# Altium schematic sheet DC_DC_5V_2.SchDoc
size Tabloid; Date: Date; Author: Author 1; DocumentNumber: 4; Revision: 1; SheetNumber: 4; SheetTotal: 7; Size: 11x17; Sheet_Name: 5V page 2
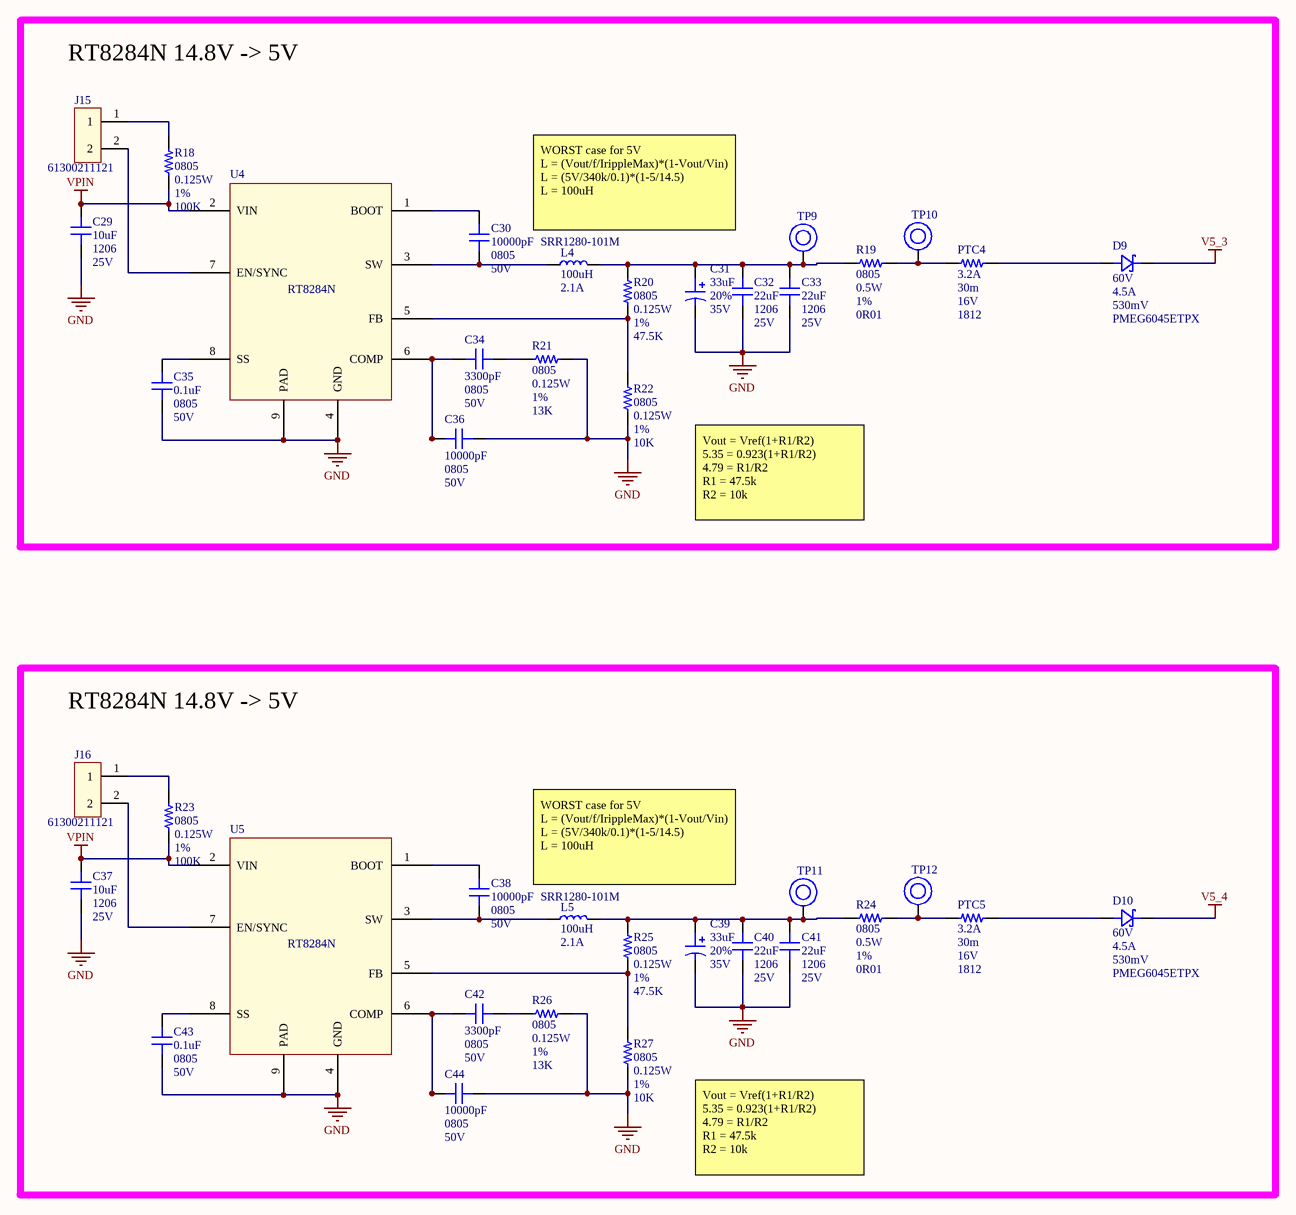
[diagram p0: DC_DC_5V_2.SchDoc]

## Parts
C29  value 10uF  Package: 1206  Voltage: 25V  [CAP_1206]  (hidden comment: CAP_‎CL31A106KAHNFNE‎)
C30  value 10000pF  Package: 0805  Voltage: 50V  [CAP_0805]  (hidden comment: CAP_‎‎‎‎CL21B103KBANNNC)
C31  value 33uF  Tolerance: 20%  Voltage: 35V  [CAP ALU - 6.3mm DIA]  (hidden comment: CAP_EEE-FK1V330P)
C32  value 22uF  Package: 1206  Voltage: 25V  [CAP_1206]  (hidden comment: CAP_‎‎CL31A226KAHNNNE‎)
C33  value 22uF  Package: 1206  Voltage: 25V  [CAP_1206]  (hidden comment: CAP_‎‎CL31A226KAHNNNE‎)
C34  value 3300pF  Package: 0805  Voltage: 50V  [CAP_0805]  (hidden comment: CAP_CL21B332KBANNNC‎)
C35  value 0.1uF  Package: 0805  Voltage: 50V  [CAP_0805]  (hidden comment: CAP_CC0805KRX7R9BB104‎)
C36  value 10000pF  Package: 0805  Voltage: 50V  [CAP_0805]  (hidden comment: CAP_‎‎‎‎CL21B103KBANNNC)
C37  value 10uF  Package: 1206  Voltage: 25V  [CAP_1206]  (hidden comment: CAP_‎CL31A106KAHNFNE‎)
C38  value 10000pF  Package: 0805  Voltage: 50V  [CAP_0805]  (hidden comment: CAP_‎‎‎‎CL21B103KBANNNC)
C39  value 33uF  Tolerance: 20%  Voltage: 35V  [CAP ALU - 6.3mm DIA]  (hidden comment: CAP_EEE-FK1V330P)
C40  value 22uF  Package: 1206  Voltage: 25V  [CAP_1206]  (hidden comment: CAP_‎‎CL31A226KAHNNNE‎)
C41  value 22uF  Package: 1206  Voltage: 25V  [CAP_1206]  (hidden comment: CAP_‎‎CL31A226KAHNNNE‎)
C42  value 3300pF  Package: 0805  Voltage: 50V  [CAP_0805]  (hidden comment: CAP_CL21B332KBANNNC‎)
C43  value 0.1uF  Package: 0805  Voltage: 50V  [CAP_0805]  (hidden comment: CAP_CC0805KRX7R9BB104‎)
C44  value 10000pF  Package: 0805  Voltage: 50V  [CAP_0805]  (hidden comment: CAP_‎‎‎‎CL21B103KBANNNC)
D9  Voltage: 60V  Current: 4.5A  Vf: 530mV  Part number: PMEG6045ETPX  [DO-214AC_SOD128]  (hidden comment: DIODE_SCH_PMEG6045ETPX)
D10  Voltage: 60V  Current: 4.5A  Vf: 530mV  Part number: PMEG6045ETPX  [DO-214AC_SOD128]  (hidden comment: DIODE_SCH_PMEG6045ETPX)
J15  Part number: 61300211121  [HDR1X2]  (hidden comment: Header 2 pin SM)
J16  Part number: 61300211121  [HDR1X2]  (hidden comment: Header 2 pin SM)
L4  value 100uH  Current: 2.1A  Part number: SRR1280-101M  [BOURNS 12.5x12.5mm]  (hidden comment: IND_SRR1280-101M)
L5  value 100uH  Current: 2.1A  Part number: SRR1280-101M  [BOURNS 12.5x12.5mm]  (hidden comment: IND_SRR1280-101M)
PTC4  Trip value: 3.2A  Res: 30m  Voltage: 16V  Package: 1812  [PTC - 1812]  (hidden comment: PTC_0ZCG0160BF2C)
PTC5  Trip value: 3.2A  Res: 30m  Voltage: 16V  Package: 1812  [PTC - 1812]  (hidden comment: PTC_0ZCG0160BF2C)
R18  value 100K  Package: 0805  Power: 0.125W  Tolerance: 1%  [RES_0805]  (hidden comment: RES_‎RMCF0805FT100K‎)
R19  value 0R01  Package: 0805  Power: 0.5W  Tolerance: 1%  [RES_0805]  (hidden comment: RES_‎‎‎‎‎ KRL1220E-M-R010-F-T5)
R20  value 47.5K  Package: 0805  Power: 0.125W  Tolerance: 1%  [RES_0805]  (hidden comment: RES_‎‎RMCF0805FT47K5‎)
R21  value 13K  Package: 0805  Power: 0.125W  Tolerance: 1%  [RES_0805]  (hidden comment: RES_‎ RC0805FR-0713KL)
R22  value 10K  Package: 0805  Power: 0.125W  Tolerance: 1%  [RES_0805]  (hidden comment: RES_‎RMCF0805FT10K0)
R23  value 100K  Package: 0805  Power: 0.125W  Tolerance: 1%  [RES_0805]  (hidden comment: RES_‎RMCF0805FT100K‎)
R24  value 0R01  Package: 0805  Power: 0.5W  Tolerance: 1%  [RES_0805]  (hidden comment: RES_‎‎‎‎‎ KRL1220E-M-R010-F-T5)
R25  value 47.5K  Package: 0805  Power: 0.125W  Tolerance: 1%  [RES_0805]  (hidden comment: RES_‎‎RMCF0805FT47K5‎)
R26  value 13K  Package: 0805  Power: 0.125W  Tolerance: 1%  [RES_0805]  (hidden comment: RES_‎ RC0805FR-0713KL)
R27  value 10K  Package: 0805  Power: 0.125W  Tolerance: 1%  [RES_0805]  (hidden comment: RES_‎RMCF0805FT10K0)
TP9  TestPoint 3x3mm  [TestPoint 3X3mm]  (value not drawn)
TP10  TestPoint 3x3mm  [TestPoint 3X3mm]  (value not drawn)
TP11  TestPoint 3x3mm  [TestPoint 3X3mm]  (value not drawn)
TP12  TestPoint 3x3mm  [TestPoint 3X3mm]  (value not drawn)
U4  REG_SW_RT8284N  [SOP8]  (value not drawn)
U5  REG_SW_RT8284N  [SOP8]  (value not drawn)

## Blocks framed on the sheet
RT8284N 14.8V -> 5V: C29-C36 D9 J15 L4 PTC4 R18-R22 TP9 TP10 U4
RT8284N 14.8V -> 5V: C37-C44 D10 J16 L5 PTC5 R23-R27 TP11 TP12 U5

## Nets
GND: C29.2 C31.2 C32.2 C33.2 C35.2 C36.2 C37.2 C39.2 C40.2 C41.2 C43.2 C44.2 R21.2 R22.2 R26.2 R27.2 U4.4(GND) U4.9(PAD) U5.4(GND) U5.9(PAD)
V5_3: D9.2
V5_4: D10.2
VPIN: C29.1 C37.1 R18.1 R23.1 U4.2(VIN) U5.2(VIN)
NetC30_1: C30.1 U4.1(BOOT)
NetC30_2: C30.2 L4.1 U4.3(SW)
NetC31_1: C31.1 C32.1 C33.1 L4.2 R19.1 R20.1 TP9.1
NetC34_1: C34.1 C36.1 U4.6(COMP)
NetC34_2: C34.2 R21.1
NetC35_1: C35.1 U4.8(SS)
NetC38_1: C38.1 U5.1(BOOT)
NetC38_2: C38.2 L5.1 U5.3(SW)
NetC39_1: C39.1 C40.1 C41.1 L5.2 R24.1 R25.1 TP11.1
NetC42_1: C42.1 C44.1 U5.6(COMP)
NetC42_2: C42.2 R26.1
NetC43_1: C43.1 U5.8(SS)
NetD9_1: D9.1 PTC4.2
NetD10_1: D10.1 PTC5.2
NetJ15_1: J15.1 R18.2
NetJ15_2: J15.2 U4.7(EN/SYNC)
NetJ16_1: J16.1 R23.2
NetJ16_2: J16.2 U5.7(EN/SYNC)
NetPTC4_1: PTC4.1 R19.2 TP10.1
NetPTC5_1: PTC5.1 R24.2 TP12.1
NetR20_2: R20.2 R22.1 U4.5(FB)
NetR25_2: R25.2 R27.1 U5.5(FB)

## Notes on the sheet
- WORST case for 5V
  L = (Vout/f/IrippleMax)*(1-Vout/Vin)
  L = (5V/340k/0.1)*(1-5/14.5)
  L = 100uH
- Vout = Vref(1+R1/R2)
  5.35 = 0.923(1+R1/R2)
  4.79 = R1/R2
  R1 = 47.5k
  R2 = 10k
- Sheet Name
- Project Title
- Global Project
- Size
- Group
- Revision
- Date
- Sheet
- of
- Filename
- Designers

## Library data of the parts
C29 C37 = CAP_‎CL31A106KAHNFNE‎: CAP CER 10uF 25V 1206; Part number: CL31A106KAHNFNE‎
C30 C36 C38 C44 = CAP_‎‎‎‎CL21B103KBANNNC: CAP CER 10000pF 50V 0805; Part number: ‎CL21B103KBANNNC
C31 C39 = CAP_EEE-FK1V330P: CAP ALU 33µF 35V; Part number: EEE-FK1V330P; Package: 6.30mm
C32 C33 C40 C41 = CAP_‎‎CL31A226KAHNNNE‎: CAP CER 22uF 25V 1206; Part number: CL31A226KAHNNNE‎
C34 C42 = CAP_CL21B332KBANNNC‎: CAP CER 3300pF 50V 0805; Part number: CL21B332KBANNNC‎
C35 C43 = CAP_CC0805KRX7R9BB104‎: CAP CER 0.1uF 50V 0805; Part number: CC0805KRX7R9BB104‎
D9 D10 = DIODE_SCH_PMEG6045ETPX: Diode Schottky 60V 4.5A Surface Mount CFP5; Package: SOD-128
L4 L5 = IND_SRR1280-101M: IND 100µH Shielded Wirewound Inductor 2.1A; Tolerance: 20%; Package: Nonstandard
PTC4 PTC5 = PTC_0ZCG0160BF2C: PTC_Polymeric PTC Resettable Fuse 16V 1.6A Ih; Part number: 0ZCG0160BF2C
R18 R23 = RES_‎RMCF0805FT100K‎: RES 100K 1% 1/8W 0805; Part number: ‎RMCF0805FT100K‎
R19 R24 = RES_‎‎‎‎‎ KRL1220E-M-R010-F-T5: RES 0.01R 1% 1/2W 0805; Part number: KRL1220E-M-R010-F-T5
R20 R25 = RES_‎‎RMCF0805FT47K5‎: RES 47.5K 1% 1/8W 0805; Part number: RMCF0805FT47K5‎
R21 R26 = RES_‎ RC0805FR-0713KL: RES 13K 1% 1/8W 0805; Part number: RC0805FR-0713KL
R22 R27 = RES_‎RMCF0805FT10K0: RES 10K 1% 1/8W 0805; Part number: RMCF0805FT10K0
U4 U5 = REG_SW_RT8284N: REG 2A, 23V, 340kHz Synchronous Step-Down Converter; Part number: RT8284N